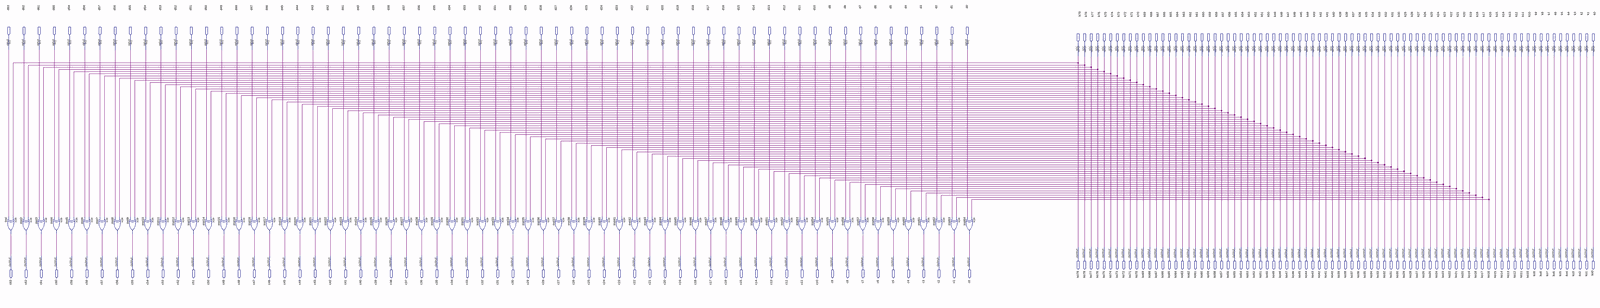
[diagram p0: schematic sheet, whole]
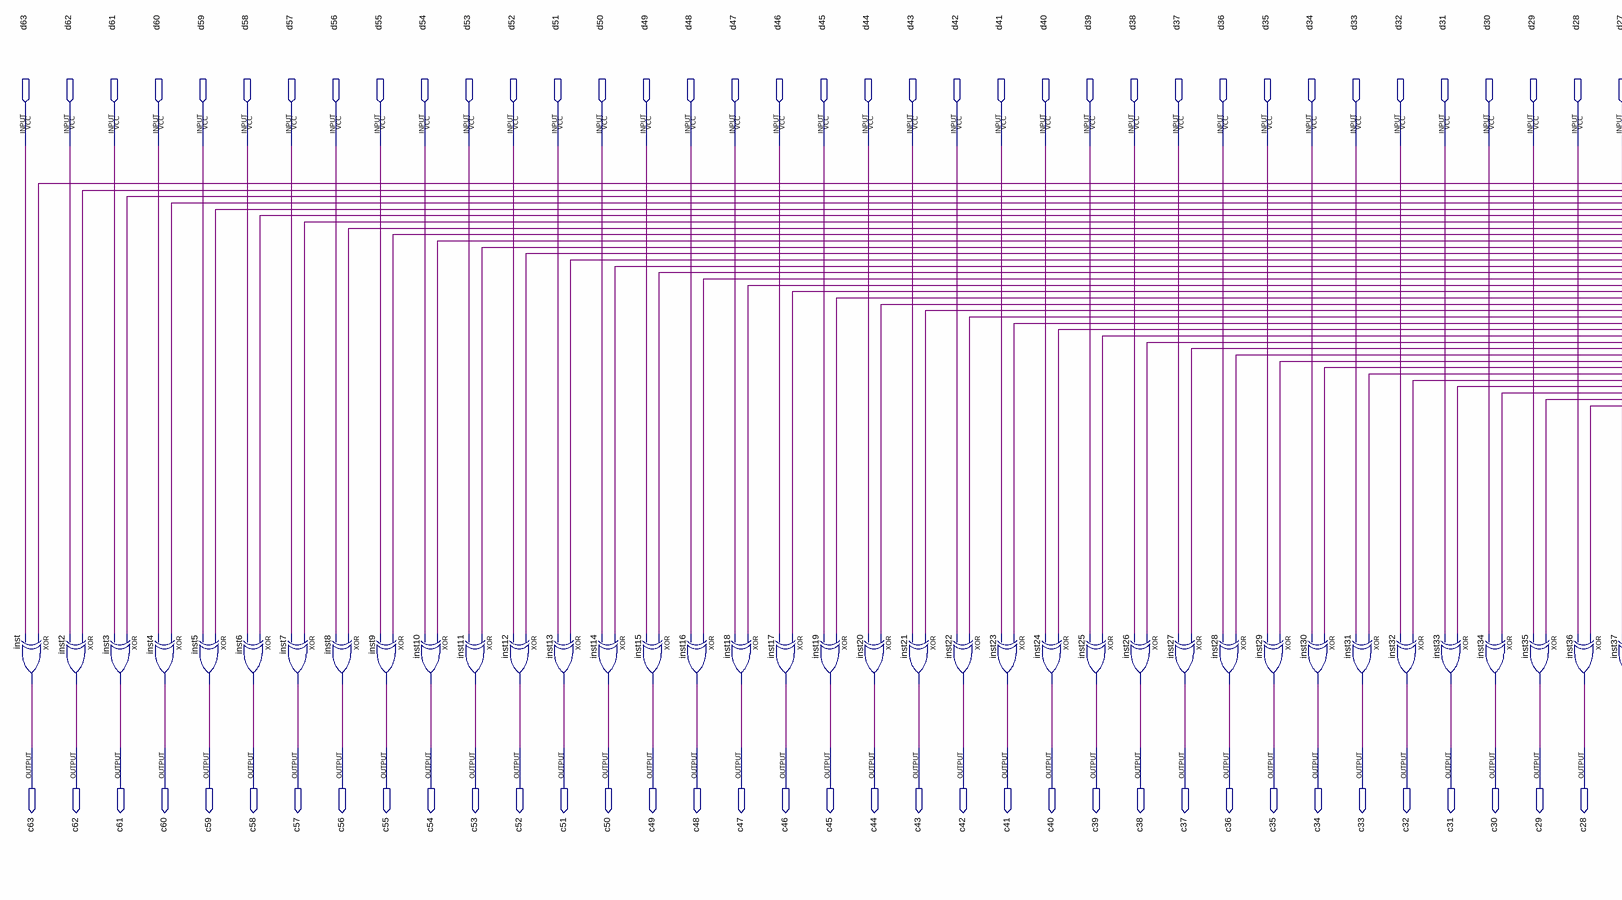
[diagram p1: schematic sheet, left part]
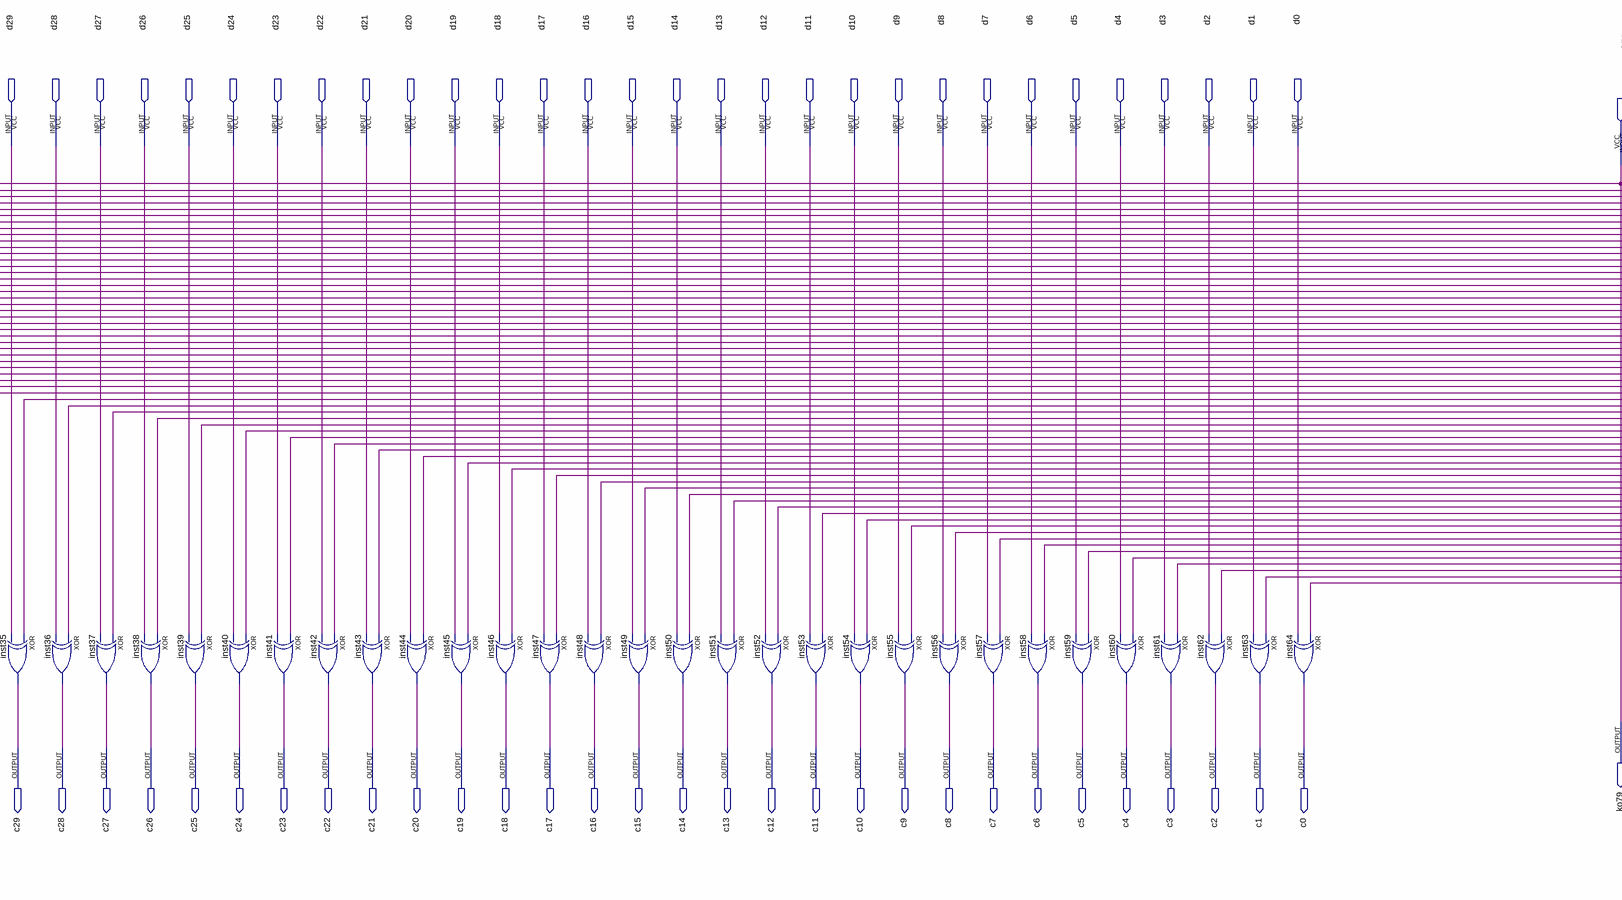
[diagram p2: schematic sheet, centre part]
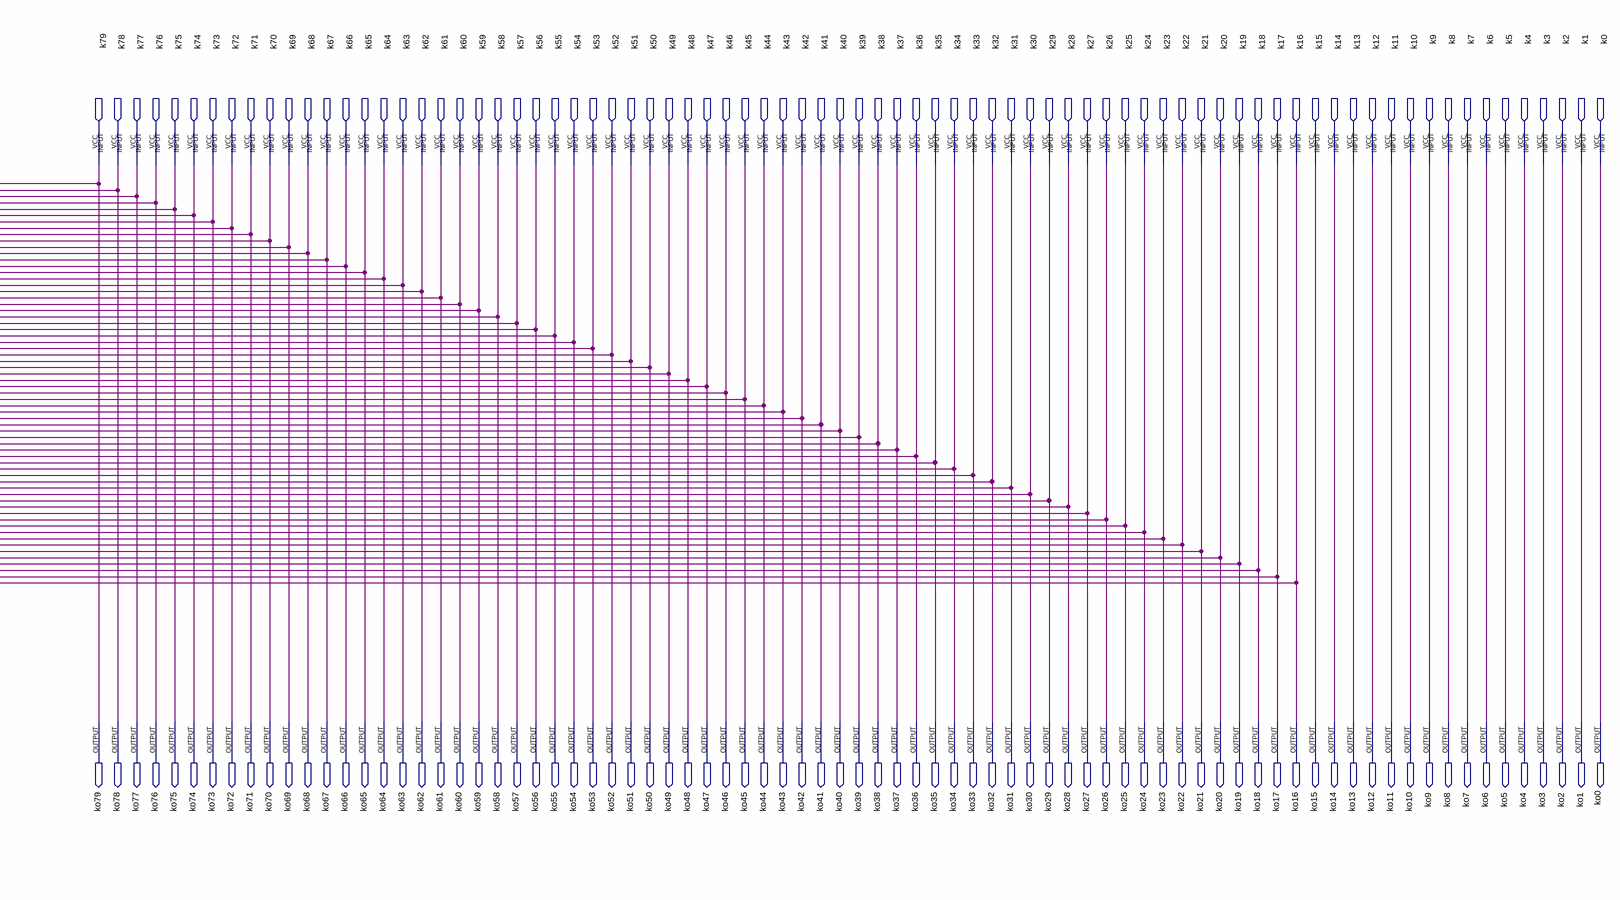
[diagram p3: schematic sheet, right part]
// Quartus schematic LastRound.bdf as structural Verilog: 64 symbols, 288 pins
module LastRound (
  input  d63,
  input  d62,
  input  d61,
  input  d60,
  input  d59,
  input  d58,
  input  d57,
  input  d56,
  input  d55,
  input  d54,
  input  d53,
  input  d52,
  input  d51,
  input  d50,
  input  d49,
  input  d48,
  input  d47,
  input  d46,
  input  d45,
  input  d44,
  input  d43,
  input  d42,
  input  d41,
  input  d40,
  input  d39,
  input  d38,
  input  d37,
  input  d36,
  input  d35,
  input  d34,
  input  d33,
  input  d32,
  input  d31,
  input  d30,
  input  d29,
  input  d28,
  input  d27,
  input  d26,
  input  d25,
  input  d24,
  input  d23,
  input  d22,
  input  d21,
  input  d20,
  input  d19,
  input  d18,
  input  d17,
  input  d16,
  input  d15,
  input  d14,
  input  d13,
  input  d12,
  input  d11,
  input  d10,
  input  d9,
  input  d8,
  input  d7,
  input  d6,
  input  d5,
  input  d4,
  input  d3,
  input  d2,
  input  d1,
  input  d0,
  input  k79,
  input  k78,
  input  k77,
  input  k76,
  input  k75,
  input  k74,
  input  k73,
  input  k72,
  input  k71,
  input  k70,
  input  k69,
  input  k68,
  input  k67,
  input  k66,
  input  k65,
  input  k64,
  input  k63,
  input  k62,
  input  k61,
  input  k60,
  input  k59,
  input  k58,
  input  k57,
  input  k56,
  input  k55,
  input  k54,
  input  k53,
  input  k52,
  input  k51,
  input  k50,
  input  k49,
  input  k48,
  input  k47,
  input  k46,
  input  k45,
  input  k44,
  input  k43,
  input  k42,
  input  k41,
  input  k40,
  input  k39,
  input  k38,
  input  k37,
  input  k36,
  input  k35,
  input  k34,
  input  k33,
  input  k32,
  input  k31,
  input  k30,
  input  k29,
  input  k28,
  input  k27,
  input  k26,
  input  k25,
  input  k24,
  input  k23,
  input  k22,
  input  k21,
  input  k20,
  input  k19,
  input  k18,
  input  k17,
  input  k16,
  input  k15,
  input  k14,
  input  k13,
  input  k12,
  input  k11,
  input  k10,
  input  k9,
  input  k8,
  input  k7,
  input  k6,
  input  k5,
  input  k4,
  input  k3,
  input  k2,
  input  k1,
  input  k0,
  output ko79,
  output ko78,
  output ko77,
  output ko76,
  output ko75,
  output ko74,
  output ko73,
  output ko72,
  output ko71,
  output ko70,
  output ko69,
  output ko68,
  output ko67,
  output ko66,
  output ko65,
  output ko64,
  output ko63,
  output ko62,
  output ko61,
  output ko60,
  output ko59,
  output ko58,
  output ko57,
  output ko56,
  output ko55,
  output ko54,
  output ko53,
  output ko52,
  output ko51,
  output ko50,
  output ko49,
  output ko48,
  output ko47,
  output ko46,
  output ko45,
  output ko44,
  output ko43,
  output ko42,
  output ko41,
  output ko40,
  output ko39,
  output ko38,
  output ko37,
  output ko36,
  output ko35,
  output ko34,
  output ko33,
  output ko32,
  output ko31,
  output ko30,
  output ko29,
  output ko28,
  output ko27,
  output ko26,
  output ko25,
  output ko24,
  output ko23,
  output ko22,
  output ko21,
  output ko20,
  output ko19,
  output ko18,
  output ko17,
  output ko16,
  output ko15,
  output ko14,
  output ko13,
  output ko12,
  output ko11,
  output ko10,
  output ko9,
  output ko8,
  output ko7,
  output ko6,
  output ko5,
  output ko4,
  output ko3,
  output ko2,
  output ko1,
  output ko0,
  output c63,
  output c62,
  output c61,
  output c60,
  output c59,
  output c58,
  output c57,
  output c56,
  output c55,
  output c54,
  output c53,
  output c52,
  output c51,
  output c50,
  output c49,
  output c48,
  output c47,
  output c46,
  output c45,
  output c44,
  output c43,
  output c42,
  output c41,
  output c40,
  output c39,
  output c38,
  output c37,
  output c36,
  output c35,
  output c34,
  output c33,
  output c32,
  output c31,
  output c30,
  output c29,
  output c28,
  output c27,
  output c26,
  output c25,
  output c24,
  output c23,
  output c22,
  output c21,
  output c20,
  output c19,
  output c18,
  output c17,
  output c16,
  output c15,
  output c14,
  output c13,
  output c12,
  output c11,
  output c10,
  output c9,
  output c8,
  output c7,
  output c6,
  output c5,
  output c4,
  output c3,
  output c2,
  output c1,
  output c0
);

  xor inst (c63, k79, d63);
  xor inst2 (c62, k78, d62);
  xor inst3 (c61, k77, d61);
  xor inst4 (c60, k76, d60);
  xor inst5 (c59, k75, d59);
  xor inst6 (c58, k74, d58);
  xor inst7 (c57, k73, d57);
  xor inst8 (c56, k72, d56);
  xor inst9 (c55, k71, d55);
  xor inst10 (c54, k70, d54);
  xor inst11 (c53, k69, d53);
  xor inst12 (c52, k68, d52);
  xor inst13 (c51, k67, d51);
  xor inst14 (c50, k66, d50);
  xor inst15 (c49, k65, d49);
  xor inst16 (c48, k64, d48);
  xor inst18 (c47, k63, d47);
  xor inst17 (c46, k62, d46);
  xor inst19 (c45, k61, d45);
  xor inst20 (c44, k60, d44);
  xor inst21 (c43, k59, d43);
  xor inst22 (c42, k58, d42);
  xor inst23 (c41, k57, d41);
  xor inst24 (c40, k56, d40);
  xor inst25 (c39, k55, d39);
  xor inst26 (c38, k54, d38);
  xor inst27 (c37, k53, d37);
  xor inst28 (c36, k52, d36);
  xor inst29 (c35, k51, d35);
  xor inst30 (c34, k50, d34);
  xor inst31 (c33, k49, d33);
  xor inst32 (c32, k48, d32);
  xor inst33 (c31, k47, d31);
  xor inst34 (c30, k46, d30);
  xor inst35 (c29, k45, d29);
  xor inst36 (c28, k44, d28);
  xor inst37 (c27, k43, d27);
  xor inst38 (c26, k42, d26);
  xor inst39 (c25, k41, d25);
  xor inst40 (c24, k40, d24);
  xor inst41 (c23, k39, d23);
  xor inst42 (c22, k38, d22);
  xor inst43 (c21, k37, d21);
  xor inst44 (c20, k36, d20);
  xor inst45 (c19, k35, d19);
  xor inst46 (c18, k34, d18);
  xor inst47 (c17, k33, d17);
  xor inst48 (c16, k32, d16);
  xor inst49 (c15, k31, d15);
  xor inst50 (c14, k30, d14);
  xor inst51 (c13, k29, d13);
  xor inst52 (c12, k28, d12);
  xor inst53 (c11, k27, d11);
  xor inst54 (c10, k26, d10);
  xor inst55 (c9, k25, d9);
  xor inst56 (c8, k24, d8);
  xor inst57 (c7, k23, d7);
  xor inst58 (c6, k22, d6);
  xor inst59 (c5, k21, d5);
  xor inst60 (c4, k20, d4);
  xor inst61 (c3, k19, d3);
  xor inst62 (c2, k18, d2);
  xor inst63 (c1, k17, d1);
  xor inst64 (c0, k16, d0);

  assign ko0 = k0;
  assign ko1 = k1;
  assign ko2 = k2;
  assign ko3 = k3;
  assign ko4 = k4;
  assign ko5 = k5;
  assign ko6 = k6;
  assign ko7 = k7;
  assign ko8 = k8;
  assign ko9 = k9;
  assign ko10 = k10;
  assign ko11 = k11;
  assign ko12 = k12;
  assign ko13 = k13;
  assign ko14 = k14;
  assign ko15 = k15;
  assign ko16 = k16;
  assign ko17 = k17;
  assign ko18 = k18;
  assign ko19 = k19;
  assign ko20 = k20;
  assign ko21 = k21;
  assign ko22 = k22;
  assign ko23 = k23;
  assign ko24 = k24;
  assign ko25 = k25;
  assign ko26 = k26;
  assign ko27 = k27;
  assign ko28 = k28;
  assign ko29 = k29;
  assign ko30 = k30;
  assign ko31 = k31;
  assign ko32 = k32;
  assign ko33 = k33;
  assign ko34 = k34;
  assign ko35 = k35;
  assign ko36 = k36;
  assign ko37 = k37;
  assign ko38 = k38;
  assign ko39 = k39;
  assign ko40 = k40;
  assign ko41 = k41;
  assign ko42 = k42;
  assign ko43 = k43;
  assign ko44 = k44;
  assign ko45 = k45;
  assign ko46 = k46;
  assign ko47 = k47;
  assign ko48 = k48;
  assign ko49 = k49;
  assign ko50 = k50;
  assign ko51 = k51;
  assign ko52 = k52;
  assign ko53 = k53;
  assign ko54 = k54;
  assign ko55 = k55;
  assign ko56 = k56;
  assign ko57 = k57;
  assign ko58 = k58;
  assign ko59 = k59;
  assign ko60 = k60;
  assign ko61 = k61;
  assign ko62 = k62;
  assign ko63 = k63;
  assign ko64 = k64;
  assign ko65 = k65;
  assign ko66 = k66;
  assign ko67 = k67;
  assign ko68 = k68;
  assign ko69 = k69;
  assign ko70 = k70;
  assign ko71 = k71;
  assign ko72 = k72;
  assign ko73 = k73;
  assign ko74 = k74;
  assign ko75 = k75;
  assign ko76 = k76;
  assign ko77 = k77;
  assign ko78 = k78;
  assign ko79 = k79;
endmodule
